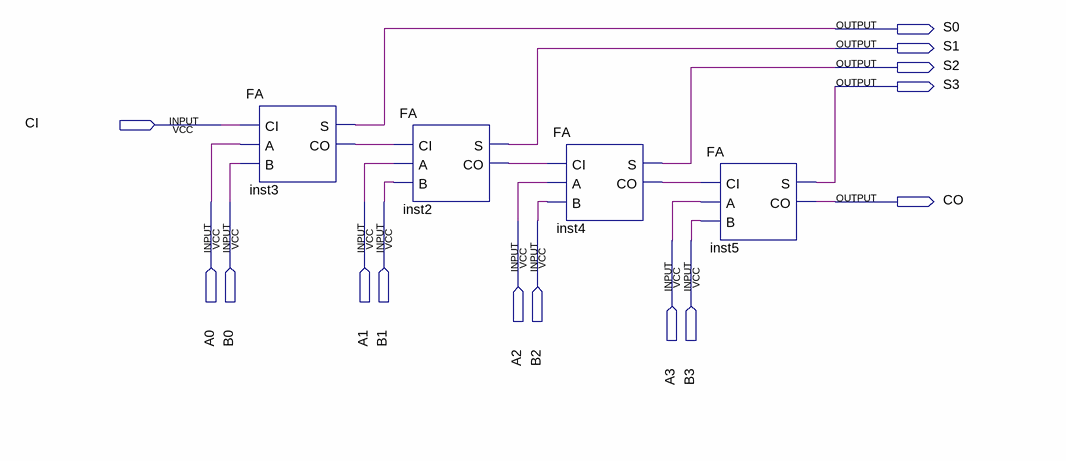
[diagram p0: schematic sheet]
// Quartus schematic adder_4B.bdf as structural Verilog: 4 symbols, 14 pins
module adder_4B (
  input  CI,
  input  A0,
  input  B0,
  input  A1,
  input  B1,
  input  A2,
  input  B2,
  input  A3,
  input  B3,
  output S0,
  output S1,
  output S2,
  output S3,
  output CO
);

  wire inst2_co, inst3_co, inst4_co;

  FA inst3 (.CI(CI), .A(A0), .B(B0), .S(S0), .CO(inst3_co));
  FA inst2 (.CI(inst3_co), .A(A1), .B(B1), .S(S1), .CO(inst2_co));
  FA inst4 (.CI(inst2_co), .A(A2), .B(B2), .S(S2), .CO(inst4_co));
  FA inst5 (.CI(inst4_co), .A(A3), .B(B3), .S(S3), .CO(CO));
endmodule
